# EAGLE design Crousel-Pogobed-Motherboard-A (EAGLE 6.2)
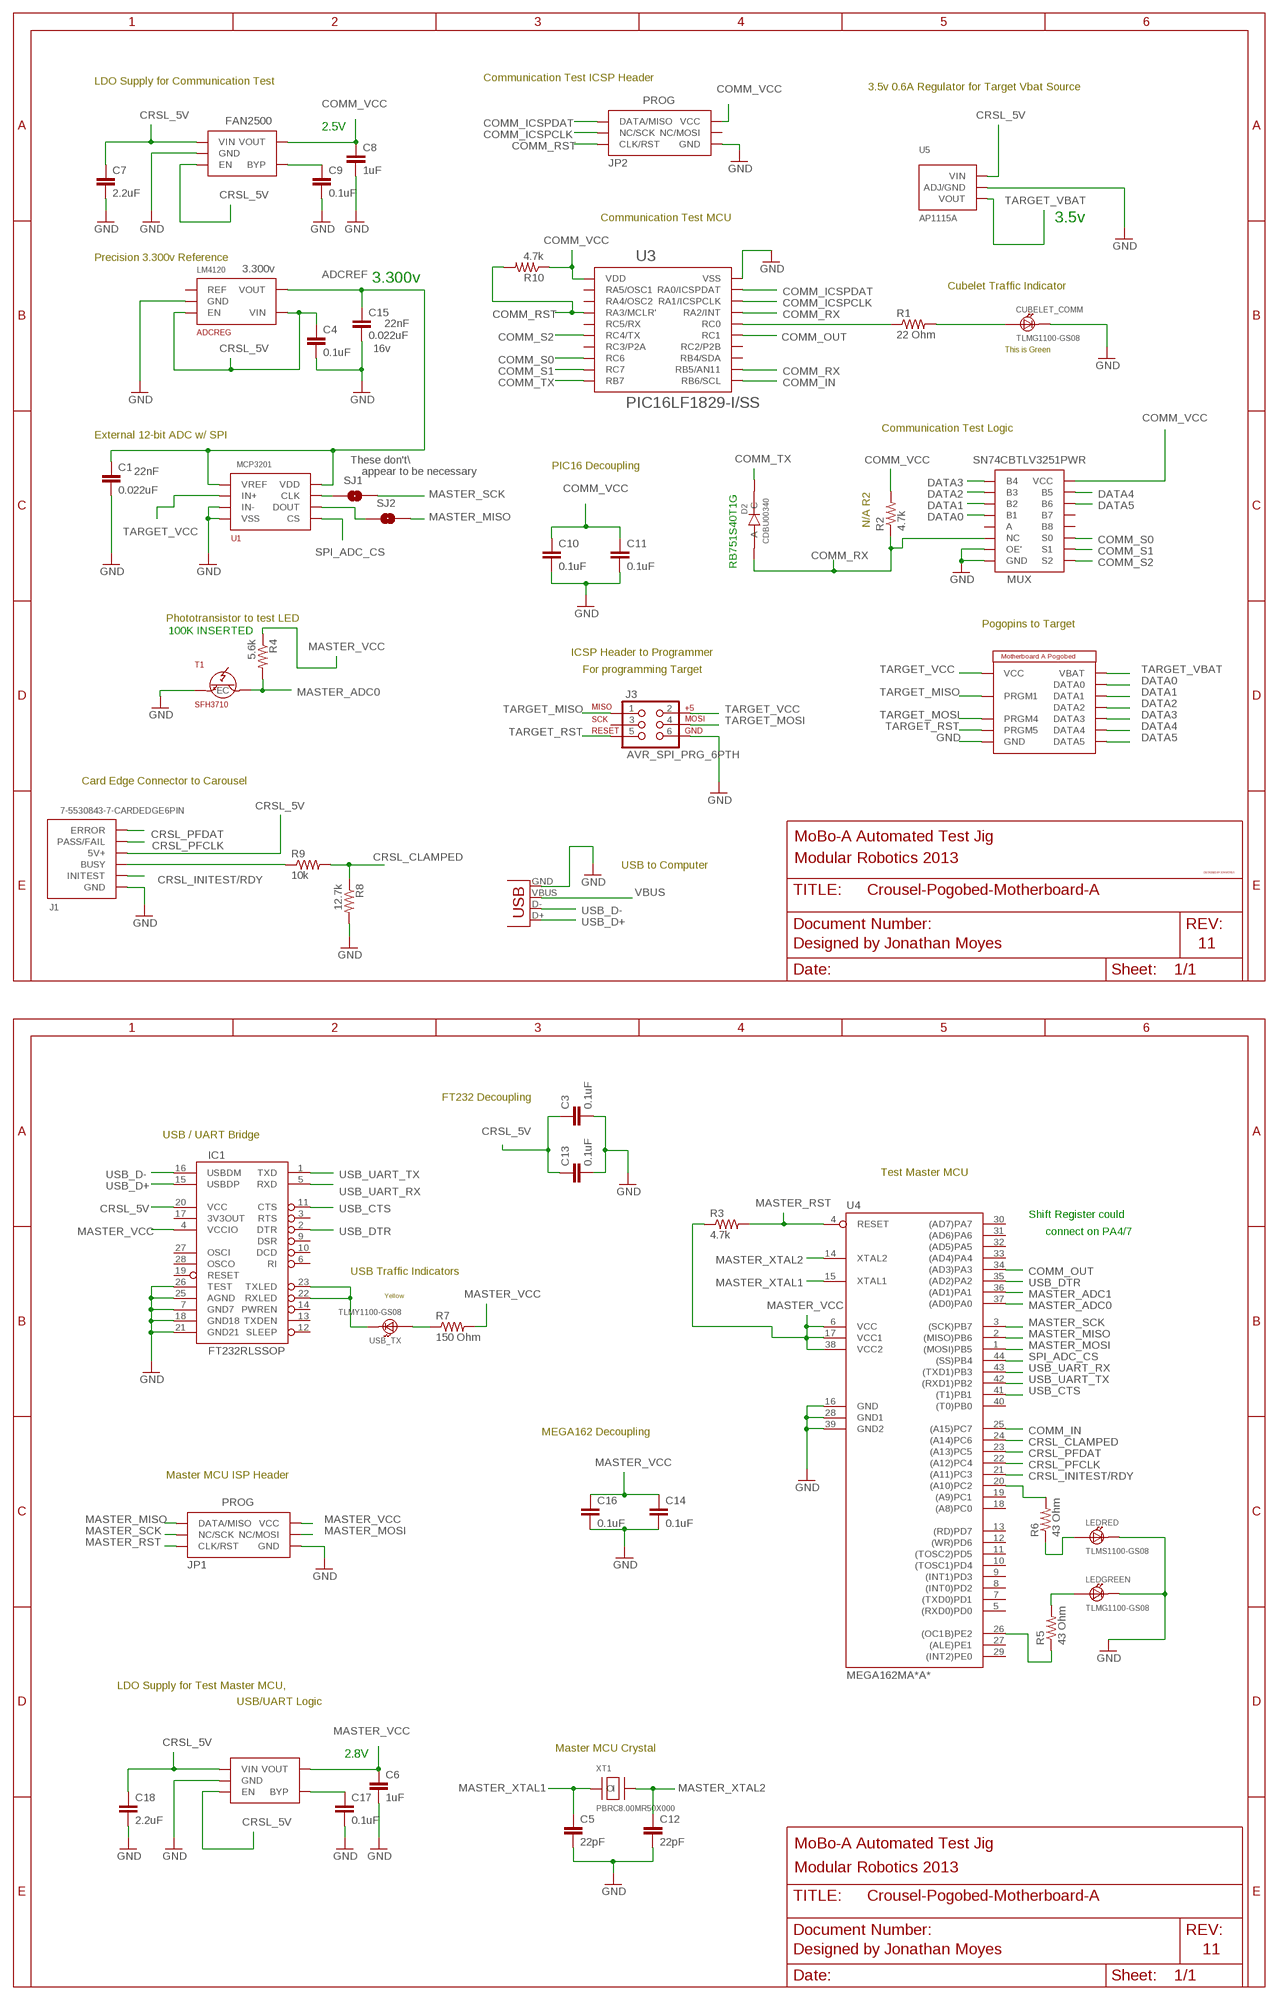
[diagram p0: schematic, sheet 1]

## Parts
2.8V  FAN2500  [FAN2500]
ADCREG  LM4120  [LM4120]
C1  0.022uF  CAP0402-CAP  [0402-CAP]
C3  0.1uF  CAP0402-CAP  [0402-CAP]
C4  0.1uF  CAP0402-CAP  [0402-CAP]
C5  22pF  CAP0402-CAP  [0402-CAP]
C6  1uF  CAP0402-CAP  [0402-CAP]
C7  2.2uF  CAP0402-CAP  [0402-CAP]
C8  1uF  CAP0402-CAP  [0402-CAP]
C9  0.1uF  CAP0402-CAP  [0402-CAP]
C10  0.1uF  CAP0402-CAP  [0402-CAP]
C11  0.1uF  CAP0402-CAP  [0402-CAP]
C12  22pF  CAP0402-CAP  [0402-CAP]
C13  0.1uF  CAP0402-CAP  [0402-CAP]
C14  0.1uF  CAP0402-CAP  [0402-CAP]
C15  0.022uF  CAP0402-CAP  [0402-CAP]
C16  0.1uF  CAP0402-CAP  [0402-CAP]
C17  0.1uF  CAP0402-CAP  [0402-CAP]
C18  2.2uF  CAP0402-CAP  [0402-CAP]
COMMREG  FAN2500  [FAN2500]
CUBELET_COMM  TLMG1100-GS08  [TLM*1100-GS08]
D2  CDBU00340  [CDBU00340]
IC1  FT232RLSSOP  [SSOP28DB]
J1  7-5530843-7-CARDEDGE6PIN  [7-5530843-7-CARDEDGE6PIN]
J2  MOBOA  [MOBOA]
J3  AVR_SPI_PRG_6PTH  [2X3]
JP1  PROG  [PROG]
JP2  PROG  [PROG]
LEDGREEN  TLMG1100-GS08  [TLM*1100-GS08]
LEDRED  TLMS1100-GS08  [TLM*1100-GS08]
MUX  SN74CBTLV3251PWR  [SN74CBTLV3251PWR]
R1  22 Ohm  RESISTOR0402-RES  [0402-RES]
R2  4.7k  RESISTOR0402-RES  [0402-RES]
R3  4.7k  RESISTOR0402-RES  [0402-RES]
R4  5.6k  RESISTOR0402-RES  [0402-RES]
R5  43 Ohm  RESISTOR0402-RES  [0402-RES]
R6  43 Ohm  RESISTOR0402-RES  [0402-RES]
R7  150 Ohm  RESISTOR0402-RES  [0402-RES]
R8  12.7k  RESISTOR0402-RES  [0402-RES]
R9  10k  RESISTOR0402-RES  [0402-RES]
R10  4.7k  RESISTOR0402-RES  [0402-RES]
SJ1  SOLDERJUMPERNO  [SJ_2S-NO]
SJ2  SOLDERJUMPERNO  [SJ_2S-NO]
T1  SFH3710  [SFH3710]
U1  MCP3201  [MCP3201]
U3  PIC16LF1829-I/SS  [PIC16LF1829-I/SS]
U4  MEGA162MA*A*  [TQFP44]
U5  AP1115A  [SOT89]
U$1  JON_MOYES_SIGNATURE  [JON_MOYES_SIGNATURE]
USB_TX  TLMY1100-GS08  [TLM*1100-GS08]
X1  USBPTH  [USB-B-PTH]
XT1  PBRC8.00MR50X000  [PBRC8.00MR50X000]

## Nets
ADCREF: ADCREG.P$5(VOUT) C1.1 C15.1 U1.P$1(VREF) U1.P$8(VDD)
COMM_ICSPCLK: JP2.P$3(NC/SCK) U3.P$18(RA1/ICSPCLK)
COMM_ICSPDAT: JP2.P$1(DATA/MISO) U3.P$19(RA0/ICSPDAT)
COMM_IN: U3.P$11(RB6/SCL) U4.25((A15)PC7)
COMM_OUT: U3.P$15(RC1) U4.34((AD3)PA3)
COMM_RST: JP2.P$5(CLK/RST) R10.2 U3.P$4(RA3/MCLR')
COMM_RX: D2.P$2(A) MUX.P$6(NC) R2.1 U3.P$12(RB5/AN11) U3.P$17(RA2/INT)
COMM_S0: MUX.P$11(S0) U3.P$8(RC6)
COMM_S1: MUX.P$10(S1) U3.P$9(RC7)
COMM_S2: MUX.P$9(S2) U3.P$6(RC4/TX)
COMM_TX: D2.P$1(C) U3.P$10(RB7)
COMM_VCC: C8.1 C10.1 C11.1 COMMREG.P$5(VOUT) JP2.P$2(VCC) MUX.P$16(VCC) R2.2 R10.1 U3.P$1(VDD)
CRSL_5V: 2.8V.P$1(VIN) 2.8V.P$3(EN) ADCREG.P$3(EN) ADCREG.P$4(VIN) C3.1 C4.1 C7.1 C13.1 C18.1 COMMREG.P$1(VIN) COMMREG.P$3(EN) IC1.20(VCC) J1.P$4(5V+) U5.3(VIN)
CRSL_CLAMPED: R8.1 R9.2 U4.24((A14)PC6)
CRSL_INITEST/RDY: J1.P$2(INITEST) U4.21((A11)PC3)
CRSL_PFCLK: J1.P$5(PASS/FAIL) U4.22((A12)PC4)
CRSL_PFDAT: J1.P$6(ERROR) U4.23((A13)PC5)
DATA0: J2.DATA0 MUX.P$4(B1)
DATA1: J2.DATA1 MUX.P$3(B2)
DATA2: J2.DATA2 MUX.P$2(B3)
DATA3: J2.DATA3 MUX.P$1(B4)
DATA4: J2.DATA4 MUX.P$15(B5)
DATA5: J2.DATA5 MUX.P$14(B6)
GND: 2.8V.P$2(GND) ADCREG.P$2(GND) C1.2 C3.2 C4.2 C5.2 C6.2 C7.2 C8.2 C9.2 C10.2 C11.2 C12.2 C13.2 C14.2 C15.2 C16.2 C17.2 C18.2 COMMREG.P$2(GND) CUBELET_COMM.C IC1.7(GND7) IC1.18(GND18) IC1.21(GND21) IC1.25(AGND) IC1.26(TEST) J1.P$3(GND) J2.PRGM6/GND(GND) J3.6 JP1.P$6(GND) JP2.P$6(GND) LEDGREEN.C LEDRED.C MUX.P$7(OE') MUX.P$8(GND) R8.2 T1.E U1.P$3(IN-) U1.P$4(VSS) U3.P$20(VSS) U4.16(GND) U4.28(GND1) U4.39(GND2) U5.2(ADJ/GND) U5.2@1(ADJ/GND) X1.GND
LED1: R6.2 U4.20((A10)PC2)
MASTER_ADC0: R4.2 T1.C U4.37((AD0)PA0)
MASTER_ADC1: U4.36((AD1)PA1)
MASTER_MISO: JP1.P$1(DATA/MISO) SJ2.2 U4.2((MISO)PB6)
MASTER_MOSI: JP1.P$4(NC/MOSI) U4.1((MOSI)PB5)
MASTER_RST: JP1.P$5(CLK/RST) R3.2 U4.4(RESET)
MASTER_SCK: JP1.P$3(NC/SCK) SJ1.2 U4.3((SCK)PB7)
MASTER_VCC: 2.8V.P$5(VOUT) C6.1 C14.1 C16.1 IC1.4(VCCIO) JP1.P$2(VCC) R3.1 R4.1 R7.2 U4.6(VCC) U4.17(VCC1) U4.38(VCC2)
MASTER_XTAL1: C5.1 U4.15(XTAL1) XT1.I
MASTER_XTAL2: C12.1 U4.14(XTAL2) XT1.O
N$1: SJ1.1 U1.P$7(CLK)
N$2: R1.1 U3.P$16(RC0)
N$3: C9.1 COMMREG.P$4(BYP)
N$4: CUBELET_COMM.A R1.2
N$5: 2.8V.P$4(BYP) C17.1
N$6: IC1.22(RXLED) IC1.23(TXLED) USB_TX.C
N$7: R5.1 U4.26((OC1B)PE2)
N$8: R7.1 USB_TX.A
N$9: LEDGREEN.A R5.2
N$10: J1.P$1(BUSY) R9.1
N$11: SJ2.1 U1.P$6(DOUT)
N$12: LEDRED.A R6.1
SPI_ADC_CS: U1.P$5(CS) U4.44((SS)PB4)
TARGET_MISO: J2.PRGM1 J3.1
TARGET_MOSI: J2.PRGM4 J3.4
TARGET_RST: J2.PRGM5 J3.5
TARGET_VBAT: J2.VBAT U5.1(VOUT)
TARGET_VCC: J2.PRGM2/VCC(VCC) J3.2 U1.P$2(IN+)
USB_CTS: IC1.11(CTS) U4.41((T1)PB1)
USB_D+: IC1.15(USBDP) X1.D+
USB_D-: IC1.16(USBDM) X1.D-
USB_DTR: IC1.2(DTR) U4.35((AD2)PA2)
USB_UART_RX: IC1.5(RXD) U4.43((TXD1)PB3)
USB_UART_TX: IC1.1(TXD) U4.42((RXD1)PB2)
VBUS: X1.VBUS
Unconnected: ADCREG.P$1(REF) IC1.3(RTS) IC1.6(RI) IC1.9(DSR) IC1.10(DCD) IC1.12(SLEEP) IC1.13(TXDEN) IC1.14(PWREN) IC1.17(3V3OUT) IC1.19(RESET) IC1.27(OSCI) IC1.28(OSCO) J3.3 JP2.P$4(NC/MOSI) MUX.P$5(A) MUX.P$12(B8) MUX.P$13(B7) U3.P$2(RA5/OSC1) U3.P$3(RA4/OSC2) U3.P$5(RC5/RX) U3.P$7(RC3/P2A) U3.P$13(RB4/SDA) U3.P$14(RC2/P2B) U4.5((RXD0)PD0) U4.7((TXD0)PD1) U4.8((INT0)PD2) U4.9((INT1)PD3) U4.10((TOSC1)PD4) U4.11((TOSC2)PD5) U4.12((WR)PD6) U4.13((RD)PD7) U4.18((A8)PC0) U4.19((A9)PC1) U4.27((ALE)PE1) U4.29((INT2)PE0) U4.30((AD7)PA7) U4.31((AD6)PA6) U4.32((AD5)PA5) U4.33((AD4)PA4) U4.40((T0)PB0)

## Notes on the sheet
- Communication Test ICSP Header
- LDO Supply for Communication Test
- 3.5v 0.6A Regulator for Target Vbat Source
- 2.5V
- Communication Test MCU | 3.5v
- Precision 3.300v Reference
- 3.300v
- 3.300v
- Cubelet Traffic Indicator
- 22nF
- 16v | This is Green
- Communication Test Logic
- External 12-bit ADC w/ SPI
- These don't\
- PIC16 Decoupling
- 22nF | appear to be necessary
- N/A R2
- RB751S40T1G
- Phototransistor to test LED
- Pogopins to Target
- 100K INSERTED
- ICSP Header to Programmer
- For programming Target
- Card Edge Connector to Carousel
- MoBo-A Automated Test Jig
- Modular Robotics 2013
- USB to Computer
- Designed by Jonathan Moyes | 11
- FT232 Decoupling
- USB / UART Bridge
- Test Master MCU
- Shift Register could
- connect on PA4/7
- USB Traffic Indicators
- Yellow
- MEGA162 Decoupling
- Master MCU ISP Header
- LDO Supply for Test Master MCU,
- USB/UART Logic
- Master MCU Crystal
- 2.8V
- MoBo-A Automated Test Jig
- Modular Robotics 2013
- Designed by Jonathan Moyes | 11

## Library data of the parts
2.8V COMMREG = roblocks:FAN2500
ADCREG = ModRobot:LM4120
C1 C3-C18 = SparkFun-Passives:CAP: Capacitor Standard 0603 ceramic capacitor, and 0.1" leaded capacitor.
CUBELET_COMM LEDGREEN = ModRobot:TLMG1100-GS08
D2 = roblocks:CDBU00340
IC1 = SparkFun-DigitalIC:FT232RL: USB UART FT232RL 4th Generation USB UART (USB <-> Serial) Controller. Spark Fun Electronics SKU : COM-00650
J1 = Cubelets_Jon:7-5530843-7-CARDEDGE6PIN
J2 = ModRobot:MOBOA
J3 = SparkFun-Connectors:AVR_SPI_PRG_6: AVR ISP 6 Pin This is the reduced ISP connector for AVR programming. Common on Arduino. This footprint will take up less PCB space and can be used with a 10-pin to 6-pin adapter such as SKU: BOB-08508
JP1 JP2 = roblocks:PROG
LEDRED = ModRobot:TLMS1100-GS08
MUX = roblocks:SN74CBTLV3251PWR
R1-R10 = SparkFun-Passives:RESISTOR: Resistor Basic schematic elements and footprints for 0603, 1206, and PTH resistors.
SJ1 SJ2 = SparkFun-Passives:SOLDERJUMPER: Solder Jumper Standard SMD solder jumper. Used to automate production. Two varients : Normally Open and Normally Closed are the same, but have different paste layers. NC will have a large amount of paste and should jumper during reflow.
T1 = ModRobot:SFH3710
U1 = ModRobot:MCP3201
U3 = roblocks:PIC16LF1829-I/SS
U4 = avr-7:MEGA162*MA: Atmel Mega162 TQFP and MLF packages
U5 = semicon-smd-ipc:AP1115A
U$1 = ModRobot:JON_MOYES_SIGNATURE
USB_TX = ModRobot:TLMY1100-GS08
X1 = SparkFun-Connectors:USB: USB Connectors USB-B-PTH is fully proven SKU : PRT-00139 USB-miniB is fully proven SKU : PRT-00587 USB-A-PCB is untested. USB-A-H is throughly reviewed, but untested. Spark Fun Electronics SKU : PRT-00437 USB-B-SMT is throughly reviewed, but untested. Needs silkscreen touching up. USB-A-S has not been used/tested USB-MB-H has not been used/tested
XT1 = ModRobot:PBRC8.00MR50X000

## Board
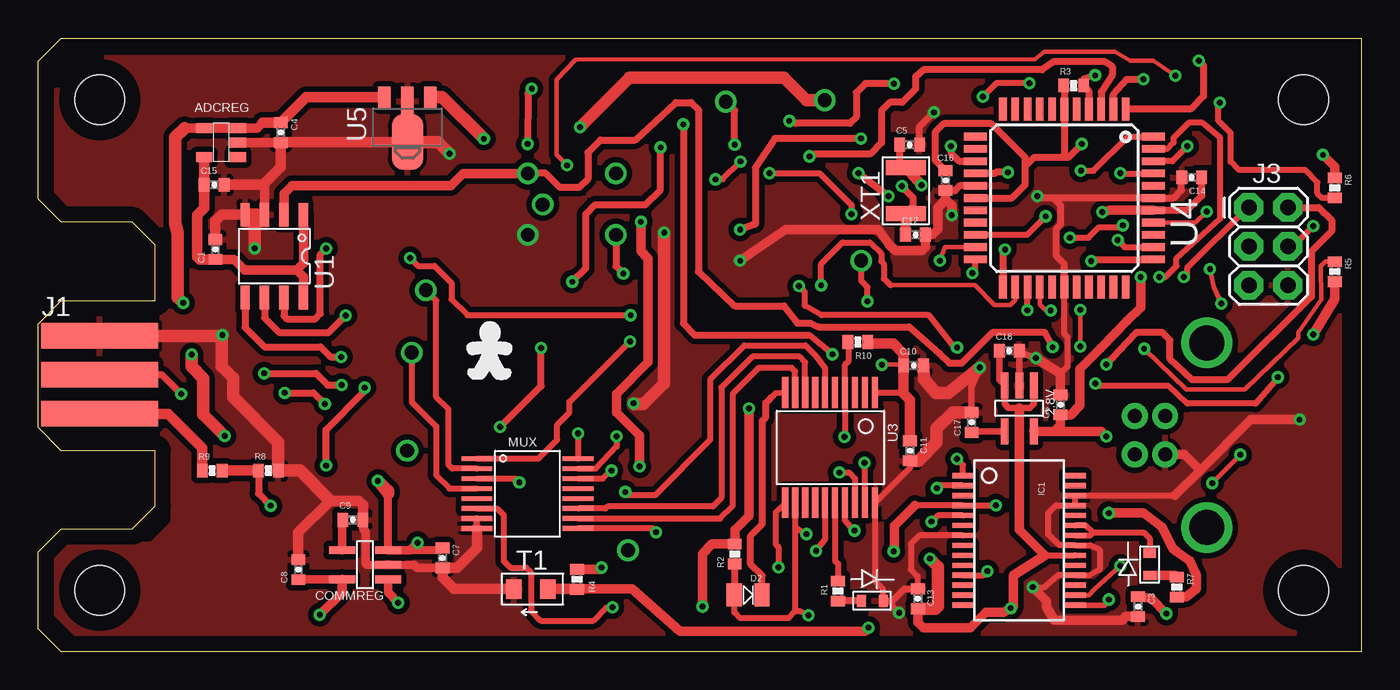
[diagram p1: board, top side]
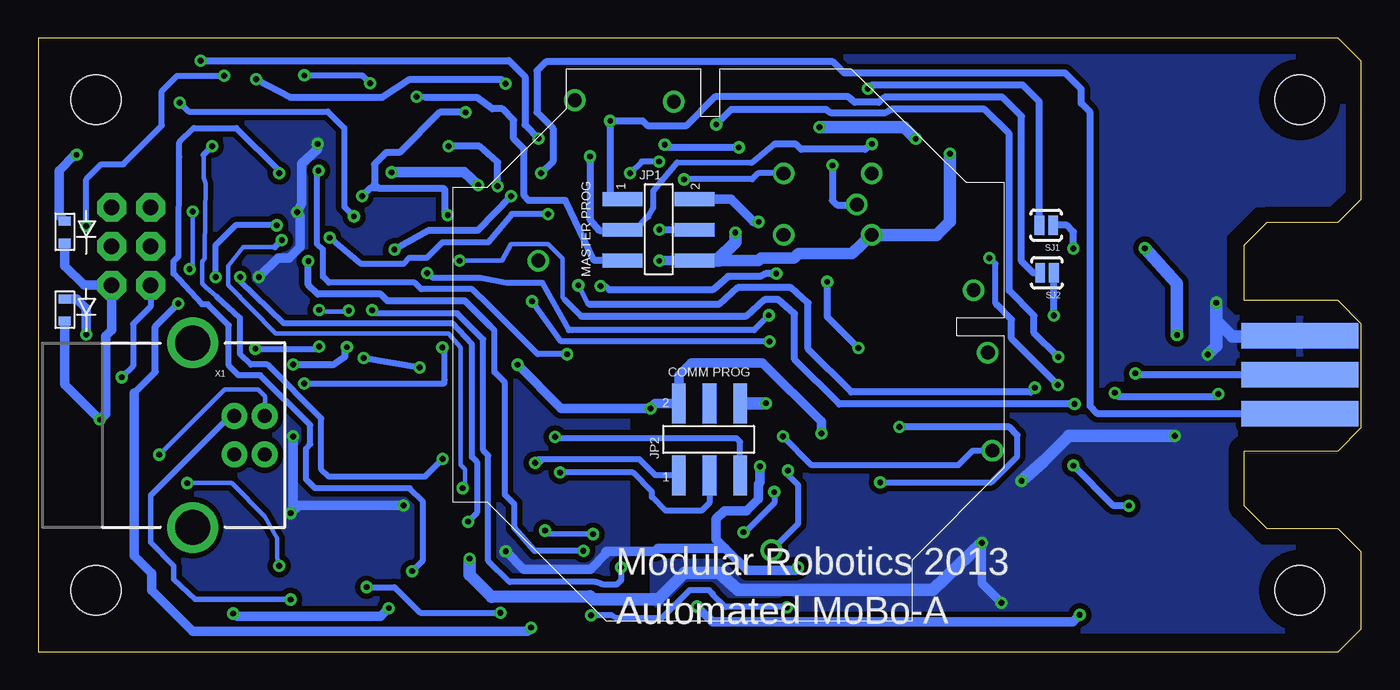
[diagram p2: board, bottom side, seen from below]

Size 86.25 x 40 mm. Coordinates in mm from the lower left corner, seen from the top.
Outline: 1.5,40 86.25,40 86.25,0 1.5,0 0,1.5 0,6.5 1.5,8 6.12,8 7.62,9.5 7.62,13.1 1.5,13.1 0,14.63 0,21.37 1.5,22.9 7.62,22.9 7.62,26.5 6.12,28 1.5,28 0,29.5 0,38.5 1.5,40
Copper layers (1*16): Top 0.035mm / dielectric 1.5mm / Bottom 0.035mm
Design rules: minimum track width 10mil, minimum drill 24mil, track to track 14mil, track to pad 14mil, pad to pad 14mil, via to via 14mil, smd to smd 14mil, copper to edge 40mil, drill to drill 8mil, minimum pad ring 10mil, minimum via ring 8mil, stop-mask expansion 4mil, vias tented up to drill 0mil, thermal gap 10mil
Holes 3.25 mm at 4,4 4,36 82.5,36 82.5,4
tKeepout: area 0.4,0.4 to 7.6,7.6; area 0.4,32.4 to 7.6,39.6; area 78.9,32.4 to 86.1,39.6; area 78.9,0.4 to 86.1,7.6

### Footprints (pad centres in the part's own frame; a part is rotated, then mirrored left to right if it is on the bottom)
FAN2500 = smd 1.7 x 0.5: P$1 0,0; P$2 0,-0.95; P$3 0,-1.9; P$4 3,-1.9; P$5 3,0
LM4120 = smd 1.06 x 0.65: P$1 0,0; P$2 0,-0.95; P$3 0,-1.9; P$4 2.2,-1.9; P$5 2.2,0
0402-CAP = smd 0.7 x 0.9: 1 -0.65,0; 2 0.65,0
TLM*1100-GS08 = smd 0.6 x 0.8: A 0,0; C 1.45,0
CDBU00340 = smd 1 x 1.5: P$1 0,0; P$2 1.8,0
SSOP28DB = smd 0.348 x 1.397: 1 -4.225,-3.656; 2 -3.575,-3.656; 3 -2.925,-3.656; 4 -2.275,-3.656; 5 -1.625,-3.656; 6 -0.975,-3.656; 7 -0.325,-3.656; 8 0.325,-3.656; 9 0.975,-3.656; 10 1.625,-3.656; 11 2.275,-3.656; 12 2.925,-3.656; 13 3.575,-3.656; 14 4.225,-3.656; 15 4.225,3.656; 16 3.575,3.656; 17 2.925,3.656; 18 2.275,3.656; 19 1.625,3.656; 20 0.975,3.656; 21 0.325,3.656; 22 -0.325,3.656; 23 -0.975,3.656; 24 -1.625,3.656; 25 -2.275,3.656; 26 -2.925,3.656; 27 -3.575,3.656; 28 -4.225,3.656
7-5530843-7-CARDEDGE6PIN = smd 7.62 x 1.651: P$1 0,0; P$2 0,2.54; P$3 0,5.08 | smd 7.62 x 1.651 bottom: P$4 0,5.08; P$5 0,2.54; P$6 0,0
MOBOA = drill 0.9 pad 0.813: DATA0 18.5,34.9; DATA1 2.134,14.427; DATA2 14.427,33.985; DATA3 12.5,5.6; DATA4 24.9,35.2; DATA5 31.394,20.803; PRGM1 6.807,21.59; PRGM2/VCC 6.807,27.33; PRGM4 8.839,26.365; PRGM5 10.82,21.59; PRGM6/GND 10.82,27.33; VBAT 2.032,7.976
2X3 = drill 1.016 pad 1.88 octagon: 1 0,0; 2 0,2.54; 3 2.54,0; 4 2.54,2.54; 5 5.08,0; 6 5.08,2.54
PROG = smd 2.6 x 0.9: P$1 0.2,0; P$2 4.88,0; P$3 0.2,-2; P$4 4.88,-2; P$5 0.2,-4; P$6 4.88,-4
SN74CBTLV3251PWR = smd 2 x 0.3: P$1 0,0; P$2 0,-0.65; P$3 0,-1.3; P$4 0,-1.95; P$5 0,-2.6; P$6 0,-3.25; P$7 0,-3.9; P$8 0,-4.55; P$9 6.6,-4.55; P$10 6.6,-3.9; P$11 6.6,-3.25; P$12 6.6,-2.6; P$13 6.6,-1.95; P$14 6.6,-1.3; P$15 6.6,-0.65; P$16 6.6,0
0402-RES = smd 0.7 x 0.9: 1 -0.65,0; 2 0.65,0
SJ_2S-NO = smd 0.635 x 1.27: 1 -0.45,0; 2 0.45,0
SFH3710 = smd 1.25 x 1: C 0,0; E 0,2.2
MCP3201 = smd 0.6 x 1.55: P$1 0,0; P$2 1.27,0; P$3 2.54,0; P$4 3.81,0; P$5 3.81,5.4; P$6 2.54,5.4; P$7 1.27,5.4; P$8 0,5.4
PIC16LF1829-I/SS = smd 2 x 0.4: P$1 0,0; P$2 0,-0.65; P$3 0,-1.3; P$4 0,-1.95; P$5 0,-2.6; P$6 0,-3.25; P$7 0,-3.9; P$8 0,-4.55; P$9 0,-5.2; P$10 0,-5.85; P$11 7.2,-5.85; P$12 7.2,-5.2; P$13 7.2,-4.55; P$14 7.2,-3.9; P$15 7.2,-3.25; P$16 7.2,-2.6; P$17 7.2,-1.95; P$18 7.2,-1.3; P$19 7.2,-0.65; P$20 7.2,0
TQFP44 = smd 1.5 x 0.5: 1 -5.8,4; 2 -5.8,3.2; 3 -5.8,2.4; 4 -5.8,1.6; 5 -5.8,0.8; 6 -5.8,0; 7 -5.8,-0.8; 8 -5.8,-1.6; 9 -5.8,-2.4; 10 -5.8,-3.2; 11 -5.8,-4; 23 5.8,-4; 24 5.8,-3.2; 25 5.8,-2.4; 26 5.8,-1.6; 27 5.8,-0.8; 28 5.8,0; 29 5.8,0.8; 30 5.8,1.6; 31 5.8,2.4; 32 5.8,3.2; 33 5.8,4 | smd 0.5 x 1.5: 12 -4,-5.8; 13 -3.2,-5.8; 14 -2.4,-5.8; 15 -1.6,-5.8; 16 -0.8,-5.8; 17 0,-5.8; 18 0.8,-5.8; 19 1.6,-5.8; 20 2.4,-5.8; 21 3.2,-5.8; 22 4,-5.8; 34 4,5.8; 35 3.2,5.8; 36 2.4,5.8; 37 1.6,5.8; 38 0.8,5.8; 39 0,5.8; 40 -0.8,5.8; 41 -1.6,5.8; 42 -2.4,5.8; 43 -3.2,5.8; 44 -4,5.8
SOT89 = smd 0.8 x 1.4: 1 -1.499,-1.981; 3 1.499,-1.981 | smd 0.8 x 1.9: 2 0,-1.727 | smd 2.032 x 3.65: 2@1 0,0.94
USB-B-PTH = drill 0.914 pad 1.676: D+ 0,1.25; D- 1.981,1.25; GND 0,-1.25; VBUS 1.981,-1.25 | drill 2.286: S1 -2.718,-6.02; S2 -2.718,6.02
PBRC8.00MR50X000 = smd 2.6 x 1: I 0,0; O 0,3

### Placement (x,y rotation side)
2.8V  64.91,17.37 270 top
ADCREG  13.02,32.25 180 top
C1  11.54,26.23 90 top
C3  71.69,2.94 270 top
C4  15.81,33.85 270 top
C5  56.81,33.06 0 top
C6  66.64,16.1 90 top
C7  26.35,6.11 270 top
C8  16.95,5.35 90 top
C9  20.51,8.6 0 top
C10  57.06,18.66 0 top
C11  56.83,13.1 270 top
C12  57.19,27.2 0 top
C13  57.34,3.45 90 top
C14  75.2,30.93 180 top
C15  11.47,30.45 0 top
C16  59.14,30.73 270 top
C17  60.85,14.95 90 top
C18  63.31,19.63 0 top
COMMREG  22.8,4.72 180 top
CUBELET_COMM  53.66,3.32 0 top
D2  47.18,3.7 180 top
IC1  63.95,7.26 270 top
J1  4,15.51 0 top
J2  59.25,38 270 bottom
J3  78.93,28.97 270 top
JP1  48.35,29.51 0 bottom
JP2  44.49,11.29 90 bottom
LEDGREEN  84.52,23 270 bottom
LEDRED  84.52,28.08 270 bottom
MUX  28.59,12.59 0 top
R1  52.13,3.95 270 top
R2  45.4,6.37 90 top
R3  67.5,36.92 0 top
R4  35.12,4.72 270 top
R5  84.52,24.78 270 top
R6  84.52,30.24 270 top
R7  74.23,4.21 270 top
R8  15,11.8 0 top
R9  11.34,11.8 0 top
R10  53.43,20.18 180 top
SJ1  20.54,27.8 180 bottom
SJ2  20.49,24.71 180 bottom
T1  33.21,4.08 90 top
U1  17.29,28.49 180 top
U3  54.55,16.91 270 top
U4  66.89,29.58 270 top
U5  24.07,34.18 180 top
U$1  29.43,19.85 0 top
USB_TX  72.45,4.97 90 top
X1  73.47,14.11 0 bottom
XT1  56.55,31.56 180 top

### Tracks (layer width: path | path; a pad name or v marks a point on that pad's centre or on a via)
ADCREF
  Top 0.61: 12.75,25.58 13.45,24.88 16.83,24.88 | 16.83,24.88 17.29,24.43 U1.P$8 | U1.P$1 17.29,25.34 16.83,24.88
  Top 0.635: C1.1 12.75,25.58
  Top 0.686: ADCREG.P$5 C15.1 10.82,28.93 10.35,28.46 10.35,25.72 10.5,25.57 C1.1
COMM_ICSPCLK  (via drill 0.38)
  Top 0.406: v52.24,11.68 52.87,11.68 53.25,11.29 U3.P$18
  Bottom 0.406: JP2.P$3 42.49,9.71 43.02,9.19 45.35,9.19 46.24,10.07 46.24,10.43 47.49,11.68 v52.24,11.68
COMM_ICSPDAT  (via drill 0.38)
  Top 0.406: U3.P$19 53.9,12.27 v53.86,12.31
  Bottom 0.406: JP2.P$1 46.01,11.49 47.05,12.54 53.38,12.54 | 53.38,12.54 53.63,12.54 v53.86,12.31 53.61,12.31 53.38,12.54
COMM_IN  (via drill 0.38)
  Top 0.406: U3.P$11 48.07,9.08 48.07,7 48.25,6.82 v48.25,5.5 | v64.48,22.27 64.48,23.77 U4.25
  Bottom 0.406: v48.25,5.5 48.25,4.67 48.55,4.36 49.39,4.36 49.54,4.41 49.95,4.54 55.51,4.54 56.91,5.94 56.91,12.79 57.24,13.12 57.24,20.36 58.94,22.06 64.22,22.06 v64.48,22.27
COMM_OUT  (via drill 0.38)
  Top 0.406: U3.P$15 51.3,7.33 v50.71,6.57
  Top 0.457: v68.64,25.47 68.76,25.58 U4.34
  Bottom 0.406: v50.71,6.57 53.89,6.57 55.21,8.07 55.21,9.62 55.82,10.23 55.82,17.54 56.5,18.23 56.5,20.95 56.81,21.25
  Bottom 0.457: 56.81,21.25 58.43,22.88 63.49,22.88 63.92,23.31 68.03,23.31 68.64,23.92 v68.64,25.47
COMM_RST  (via drill 0.38)
  Top 0.406: v52.57,14.01 52.6,14.04 U3.P$4 52.6,18.72 52.84,18.96 52.84,20.12 R10.2
  Bottom 0.406: JP2.P$5 40.49,13.67 40.73,13.91 52.46,13.91 v52.57,14.01
COMM_RX  (via drill 0.38)
  Top 0.406: v53.2,7.89 53.18,7.89 52.59,8.55 U3.P$17 | 49.35,8.14 49.35,2.62 | 49.35,2.62 48.91,2.18 45.76,2.18 45.38,2.56 D2.P$2 | U3.P$12 49.35,8.14 | 49.35,8.14 v50.08,7.66 | v37.43,2.89 37.02,2.86 36.18,2.02 32.75,2.02 32.12,2.66 32.12,5.17 31.81,5.48 30.77,5.48 30.34,5.91 30.34,8.91 29.91,9.34 MUX.P$6 | v50.2,2.38 49.69,2.62 49.35,2.62
  Top 0.457: R2.1 45.4,3.72 D2.P$2
  Bottom 0.406: v50.08,7.66 52.97,7.69 v53.2,7.89 | v37.43,2.89 37.48,2.91 41.44,2.91 42.28,3.75 42.28,3.78 42.51,4 43.78,4 45.61,2.18 48.58,2.18 48.88,2.38 v50.2,2.38
COMM_S0
  Top 0.406: U3.P$8 50,18.87 49.62,19.25 46.55,19.25 44.54,17.24 44.54,10.02 43.98,9.47 37.1,9.47 36.97,9.34 MUX.P$11
COMM_S1
  Top 0.406: U3.P$9 49.35,18.27 49.11,18.51 46.95,18.51 45.28,16.83 45.28,9.52 44.45,8.69 MUX.P$10
COMM_S2  (via drill 0.38)
  Top 0.406: v38.27,10.41 38.47,10.2 40.2,10.2 43.8,13.81 43.8,17.75 46.04,19.98 50,19.98 50.61,19.37 50.81,19.14 51.07,18.79 51.3,18.48 U3.P$6 | v40.27,7.79 40.02,8.04 MUX.P$9
  Bottom 0.406: v38.27,10.41 38.27,9.69 40.17,7.79 v40.27,7.79
COMM_TX
  Top 0.356: 47.77,16.55 48.09,16.88 48.67,16.88 U3.P$10
  Top 0.457: D2.P$1 47.18,4.97 46.44,5.71 46.44,7.56 47.21,8.32 47.21,15.05 47.44,15.28 47.44,16.22 47.77,16.55
COMM_VCC  (via drill 0.38)
  Top 0.305: v55,18.71 56.36,18.71 C10.1
  Top 0.406: U3.P$1 56.33,16.91 56.41,17 | v35.19,14.24 MUX.P$16
  Top 0.432: MUX.P$16
  Top 0.533: 56.85,13.73 C11.1
  Top 0.559: C8.1 16.97,4.72 COMMREG.P$5
  Top 0.61: COMMREG.P$5 19.8,3.85 v18.35,2.41 | v43.3,2.94 43.3,6.39 43.93,7.03 R2.2 45.43,7.04 45.43,7.94 46.34,8.86 v46.34,15.87
  Top 0.686: 56.33,16.91 56.83,16.4 C11.1 | 56.41,17 C10.1 56.4,18.67 56.4,19.42 55.74,20.08 54.18,20.08 R10.1
  Bottom 0.61: v18.35,2.41 18.81,1.95 42.3,1.95 v43.3,2.94 | v55,18.71 52.16,15.87 v46.34,15.87 46.04,16.18 JP2.P$2 44.49,18.05 43.7,18.84 39.03,18.84 35.19,15 v35.19,14.24
CRSL_5V  (via drill 0.38)
  Top 0.406: 65.64,6.28 IC1.20
  Top 0.432: C18.1 62.66,17.71 2.8V.P$3 63.01,16.14 63.26,15.89 63.97,15.89 64.66,15.89 64.91,16.15 2.8V.P$1
  Top 0.533: 26.21,6.62 COMMREG.P$3 22.8,10.3
  Top 0.559: COMMREG.P$1 22.8,3.85 v23.46,3.19 | v24.73,7.1 24.24,6.62 COMMREG.P$3 | C7.1 26.21,6.62
  Top 0.61: C13.1 57.34,1.92 57.72,1.54 60.77,1.54 61.79,2.56 62.93,2.56 v63.4,2.84 | v63.4,2.84 63.56,2.94 63.56,3.06 | 63.56,3.06 63.56,4.97 65.64,6.28 63.97,7.95 63.97,15.89 | C3.1 72.57,3.46 v73.55,2.48 | v63.4,2.84 63.4,2.9 63.56,3.06
  Top 0.635: 14.62,34.51 14.26,34.15 ADCREG.P$3 ADCREG.P$4 9.53,34.15
  Top 0.686: 14.62,34.51 15.8,34.51 C4.1 17.47,36.16 U5.3
  Top 0.813: 9.53,34.15 8.93,33.55 8.93,27.91 9.08,27.3 9.08,23.11 v9.44,22.75 | v12.15,14.06 10.76,15.46 10.76,17.82 10,18.58 v10,19.37 | C13.1 58.49,2.8 58.66,2.96 58.66,5.53 v58.13,6.06 | 22.8,10.3 22.8,10.48 v22.14,11.14 22.8,10.3
  Bottom 0.559: v23.46,3.19 24.73,4.46 v24.73,7.1
  Bottom 0.61: v73.55,2.48 73.29,2.3 63.93,2.3 v63.4,2.84
  Bottom 0.813: v9.44,22.75 9.44,21.61 | 9.44,21.61 8.4,20.57 4.03,20.57 J1.P$4 | 9.44,21.61 9.44,19.93 v10,19.37 | v12.15,14.06 19.06,14.06 20.76,12.36 v22.14,11.14 | v24.73,7.1 27.93,4.03 40.63,4.03 41.87,5.15 44.11,5.15 45.84,3.42 50.08,3.42 50.28,3.6 56.71,3.57 58.13,5 v58.13,6.06
  pour Bottom: 4,39.01 42.61,39.01 46.16,35.45 46.16,3.32 44.26,1.41 3.37,1.41 1.72,3.06 1.72,5.35 3.11,6.75 6.54,6.75 8.19,8.4 8.19,13.86 7.68,14.37 2.48,14.37 1.21,15.64 1.21,20.72 2.22,21.73 8.32,21.73 8.95,22.37 8.95,27.2 6.92,29.23 2.1,29.23 1.08,30.24 1.08,36.09
CRSL_CLAMPED  (via drill 0.38)
  Top 0.305: U4.24 63.69,22.93 63.36,22.6 62.34,22.6 61.05,23.89 55.56,23.89
  Top 0.406: v51.04,23.89 51.04,25.29 52.44,26.69 54.22,26.69 54.95,25.95 54.95,25.47 55.13,25.29 55.13,24.32 55.56,23.89
  Top 0.457: R8.1 14.35,10.32 v15.15,9.52 | v18.76,12.13 18.76,14.47 21.27,16.98 v21.27,17.21
  Top 0.686: R9.2 R8.1
  Bottom 0.305: 50.28,22.65 50.41,22.65 v51.04,23.89
  Bottom 0.457: v15.15,9.52 16.14,9.52 v18.76,12.13 | v21.27,17.21 21.55,16.93 33.24,16.93 36.06,19.75 36.06,22.75 37.17,23.74 40.65,23.74 41.87,22.65 50.28,22.65
CRSL_INITEST/RDY  (via drill 0.38)
  Top 0.305: U4.21 59.12,26.38 v58.79,25.49
  Top 0.457: v9.31,16.81 8.07,18.05 J1.P$2 | v16.07,16.88 17.95,16.88 v18.68,16.15
  Bottom 0.305: 51.93,22.95 52.06,23.08 52.06,25.65 53,26.59 55.44,26.59 56.02,25.49 v58.79,25.49
  Bottom 0.33: 9.41,16.7 v9.31,16.81
  Bottom 0.406: 50.84,21.86 51.93,22.95
  Bottom 0.457: v9.31,16.81 9.49,16.63 15.81,16.63 v16.07,16.88 | v18.68,16.15 34.02,16.15 36.95,19.07 36.95,22.04 37.99,22.95 38.9,22.95 40.12,21.86 50.84,21.86
CRSL_PFCLK  (via drill 0.38)
  Top 0.381: v38.62,21.94 27.98,21.94 26.94,22.98 26.94,24.04 25.82,25.16 24.75,25.16 v24.24,25.67
  Top 0.406: v60.9,24.68 61.09,24.88 U4.22
  Top 0.457: v14.72,18.15 18.1,18.15 18.86,17.39 v19.77,17.39
  Bottom 0.33: 14.62,18.05 v14.72,18.15
  Bottom 0.381: 23.76,22.62 23.84,22.7 23.84,25.29 24.22,25.67 v24.24,25.67 | v38.62,21.94 39.59,20.97 51.42,20.97
  Bottom 0.406: 51.42,20.97 51.65,20.97 53.38,24.04 55.74,24.04 57.42,24.38 60.52,24.38 60.82,24.68 v60.9,24.68
  Bottom 0.457: J1.P$5 14.62,18.05 | v19.77,17.39 22.8,20.41 22.8,21.66 23.76,22.62
CRSL_PFDAT  (via drill 0.38)
  Top 0.457: v63.03,26.23 62.89,26.09 U4.23 | v53.48,31.21 54.98,30.06 v55.44,29.71
  Bottom 0.457: J1.P$6 17.18,15.51 17.67,15.99 17.67,35.17 18.25,35.76 18.25,36.7 19.29,37.74 33.69,37.74 34.43,38.47 53.15,38.47 53.73,37.89 53.73,35.17 52.69,34.13 52.69,31.97 v53.48,31.21 | v55.44,29.71 57.59,27.47 60.8,27.47 v63.03,26.23
DATA0
  Top 0.406: J2.DATA0 24.35,16.3 25.95,14.7 25.95,11.5 26.81,10.63 MUX.P$4
DATA1  (via drill 0.38)
  Top 0.406: MUX.P$3 31.11,11.29 v31.36,11.04
  Top 0.457: v30.11,14.65 32.78,17.31 v32.78,19.8 | v34.81,24.12 35.7,25.01 35.7,28.54 36.31,29.15 39.59,29.15 40.55,30.12 40.55,32.86 v40.58,32.89 | v45.4,33.06 45.4,35.28 J2.DATA1
  Bottom 0.406: v31.36,11.04 24.12,11.04 22.42,12.74 22.42,14.11
  Bottom 0.457: 22.42,14.11 22.95,14.65 v30.11,14.65 | v32.78,19.8 34.81,21.84 v34.81,24.12 | v40.58,32.89 45.23,32.89 v45.4,33.06
DATA2
  Top 0.406: MUX.P$2 26.98,11.94 26.73,12.18 26.73,15.82 25.95,16.6 25.95,22.89 J2.DATA2
DATA3  (via drill 0.38)
  Top 0.406: MUX.P$1 32.6,12.59 33.82,13.81 33.82,14.8 34.63,15.61 34.63,16.3 v38.57,20.23 | v54.06,22.85 54.06,23.77 53.66,24.17 J2.DATA3
  Bottom 0.406: v38.57,20.23 52.16,20.23 v54.06,22.85
DATA4  (via drill 0.38)
  Top 0.406: v37.71,14.04 37.71,13.38 36.34,11.93 35.2,11.93 MUX.P$15
  Bottom 0.406: J2.DATA4 25.33,13.1 26.28,12.16 35.83,12.16 v37.71,14.04
DATA5  (via drill 0.38)
  Top 0.406: MUX.P$14 36.81,11.29 v37.38,11.8
  Bottom 0.406: v37.38,11.8 37.35,11.5 36.72,10.86 36.72,8.33 J2.DATA5
GND  (via drill 0.38)
  Top 0.406: 74.11,10.18 IC1.26 IC1.25 67.59,9.54 66.36,9.54 65.85,9.03 65.85,7.64 66.56,6.93 IC1.21 68.59,6.93 69.2,6.62 69.2,5.35 68.53,4.98 IC1.18 66.5,4.98 66.48,4.97 65.72,4.33 65.6,4.21 v64.83,4.21 | CUBELET_COMM.C 55.05,3.37 55.05,4.08 54.55,4.59 U3.P$20 56.83,11.99 C11.2 | IC1.7 57.44,7.58 56.88,7.03 56.88,5.35 57.32,4.92 57.32,4.12 C13.2 | v56.12,2.53 55.69,2.96 55.69,3.32 | U4.28 66.89,20.72 67.09,20.52 67.09,18.58 66.64,18.13
  Top 0.432: 2.8V.P$2 C18.2 64.25,19.4 v65.04,19.14 | C17.2 60.85,17.26 v61.38,18.53 | MUX.P$7 MUX.P$8
  Top 0.457: CUBELET_COMM.C 55.69,3.32 56.45,4.08 57.33,4.08 C13.2 | U4.16 60.07,30.38 59.75,30.06 59.16,30.06 C16.2 59.16,30.12 | v58.38,35.17 57.46,34.25 C5.2 | 74.54,30.92 74.54,30.09 74.03,29.58 U4.39 66.18,29.58 | 66.18,29.58 65.27,29.58 v65.14,29.71 | U4.28 66.89,25.29 66.38,25.8 66.38,27.6 66.66,27.88 66.66,29.1 66.18,29.58
  Top 0.508: 2.8V.P$2
  Top 0.533: 21.42,5.66 22.79,5.66 | COMMREG.P$2 24.49,5.67
  Top 0.559: 21.17,8.61 C9.2 21.16,8 21.32,7.84 21.32,5.76 21.42,5.66 | 16.93,6.03 C8.2 | 22.79,5.66 COMMREG.P$2 | 24.49,5.67 24.7,5.45 26.34,5.45 C7.2
  Top 0.584: 74.54,30.92 C14.2
  Top 0.61: C3.2 70.92,2.29 70.68,2.05 66.25,2.03 65.72,2.94 65.72,3.32 v64.83,4.21 | 74.11,10.18 75.76,11.83 | 14.24,28.49 U1.P$3 14.75,30.34 14.64,30.45 | v59.55,28.46 59.55,29.07 59.14,29.48 | C16.2 59.14,29.48 | 58.64,28.87 58.64,28.97 59.14,29.48 | C6.2 66.64,18.13 v65.04,19.14 | 75.76,11.83 74.72,12.86 X1.GND | 75.76,11.83 79.06,15.13 v82.23,15.13
  Top 0.635: C4.2 ADCREG.P$2 | v45.76,25.49 48.71,27.52 54.78,27.52 55.46,26.59 55.46,26.56 55.87,26.15 57.62,26.15 57.84,26.37 C12.2 58.28,27.2 58.64,27.55 58.64,28.87
  Top 0.686: C15.2 14.64,30.45 15.81,31.61 C4.2 | C1.2 11.54,28.08 11.95,28.49 U1.P$4 | C4.2 | C4.2 15.85,33.24 U5.2@1 U5.2 | 21.17,8.61 21.17,9.57 20.89,9.85 19.01,9.85 16.93,7.76 16.93,6.03 | T1.E 27.11,4.08 26.35,4.84 C7.2 27.3,5.46 28.61,6.77 28.61,8.01 MUX.P$8
  Top 0.813: U1.P$4 14.24,28.49 14.11,28.31 v14.11,26.31 | J1.P$3 11.95,20.59 | 11.95,20.59 v12,20.64 | 11.95,20.59 11.95,18.58 12.69,17.85 12.69,16.6 15.65,13.64 R8.2 17.06,11.8 19.01,9.85 | U5.2@1 26.05,33.24 v26.81,32.48 | v38.8,16.2 38.85,16.15 39.46,16.15 40.81,17.49 v40.81,27.32 | C11.2 57.38,12.45 58.56,13.63 58.56,14.55 59.63,15.61 60.84,15.61 C17.2 | C10.2 57.75,17.77 58.51,16.88 59.32,16.88 v61.38,18.53
  Bottom 0.406: v64.83,4.21 63.03,4.21 61.35,2.53 v56.12,2.53
  Bottom 0.432: v61.38,18.53 v65.04,19.14
  Bottom 0.457: v58.38,35.17 60.08,35.17 62.7,32.55 63.56,32.55 64.33,31.79 64.33,30.5 64.05,30.22 | 64.05,30.22 59.86,30.22 59.75,30.12 59.75,28.67 v59.55,28.46 | 64.05,30.22 64.63,30.22 v65.14,29.71
  Bottom 0.61: LEDGREEN.C 84.52,17.42 v82.23,15.13 81.85,15.51 81.85,20.59 81.47,20.97 J3.6 83.25,23.89 84.52,25.16 LEDRED.C
  Bottom 0.635: JP1.P$6 45.75,25.51 v45.76,25.49
  Bottom 0.762: J2.PRGM6/GND 33.2,25.95 36.69,25.95 36.97,25.67 39.13,25.67 39.29,25.51 42.08,25.51
  Bottom 0.813: v12,20.64 12,24.02 v14.11,26.31 | v26.81,32.48 26.81,28.06 27.7,27.17 31.91,27.17 J2.PRGM6/GND | 43.43,25.47 JP1.P$6 42.08,25.51 42.03,25.51 | 42.03,25.51 41.86,25.51 | v38.8,16.2 40.47,16.2 JP2.P$6 | v40.81,27.32 40.81,26.73 42.03,25.51
  pour Top: 6.29,38.75 82.49,38.75 84.77,36.47 84.77,4.08 81.85,1.16 2.48,1.16 1.08,2.56 1.08,6.37 1.72,7 7.43,7 8.83,8.4 8.83,13.22 8.07,13.99 2.48,13.99 1.21,15.26 1.21,20.59 2.35,21.73 7.68,21.73 8.45,22.5 8.45,27.2 6.54,29.1 1.97,29.1 1.08,29.99 1.08,36.47 3.37,38.75
LED1  (via drill 0.38)
  Top 0.381: R6.2 83.7,29.59 83.4,29.89 83.4,30.6 82.59,31.41 78.27,31.41 77.74,31.94 77.74,33.82 76.92,34.64 76.92,35.7 v77.03,35.81 | v65.67,28.39 64.47,27.18 U4.20
  Bottom 0.381: v77.03,35.81 76.44,35.22 67.37,35.22 66.31,34.16 66.31,29.02 v65.67,28.39
MASTER_ADC0  (via drill 0.38)
  Top 0.305: U4.37 75.43,27.98 v76.19,28.69 | v77.13,22.7 76.64,23.77 v76.39,24.96
  Top 0.61: R4.2 35.1,4.08 38.72,4.08 41.82,1.34 53.89,1.34 v54.12,1.57
  Top 0.686: T1.C 35.1,4.08
  Bottom 0.305: v76.39,24.96 76.24,25.06 76.19,25.16 v76.19,28.69
  Bottom 0.457: 80,16.88 78.63,18.25 78.63,21.2 v77.13,22.7
  Bottom 0.61: v54.12,1.57 54.34,1.34 76.19,1.34 78.86,4 78.86,5.1 80,6.24 80,16.88
MASTER_MISO  (via drill 0.38)
  Top 0.457: U4.2 70.09,36.36 70.95,37.33 v72.05,37.33 | v55.79,37.05 53.91,37.05 53.33,36.47 53.33,34.87 52.92,34.46 49.39,34.46 v48.96,34.61
  Bottom 0.457: SJ2.2 21.38,24.71 22.14,25.47 22.14,34.92 23.38,36.16 31.08,36.16 31.46,35.83 33.01,35.83 33.41,36.19 42.13,36.19 44.03,34.28 46.5,34.28 46.83,34.61 v48.96,34.61 48.96,29.76 JP1.P$1 | v72.05,37.33 69.81,36.16 63.82,36.16 62.04,37.33 56.07,37.33 v55.79,37.05
MASTER_MOSI  (via drill 0.38)
  Top 0.457: v53.63,33.47 48.02,33.47 46.75,31.56 46.75,27.88 v45.76,27.52 | U4.1 75.13,35.38 75.96,36.21 75.96,38.24 v75.65,38.55
  Bottom 0.457: v75.65,38.55 55.56,38.55 54.52,37.51 54.52,34.36 v53.63,33.47 | v45.76,27.52 43.49,27.52 JP1.P$4
MASTER_RST  (via drill 0.38)
  Top 0.406: R3.2 68.15,37.4 v68.9,37.58 | v64.61,37.08 62.47,37.08 v61.58,36.19
  Top 0.457: U4.4 68.49,36.58 R3.2
  Bottom 0.406: v68.9,37.58 65.14,37.58 v64.61,37.08 | v61.58,36.19 61.02,36.19 60.97,36.14
  Bottom 0.457: JP1.P$5 50.01,25.51 51.88,29.43 54.29,29.43 54.57,29.73 54.57,32.76 55.26,33.44 55.26,34.66 56,35.4 56.66,35.4 57.65,36.14 60.97,36.14
MASTER_SCK  (via drill 0.38)
  Top 0.457: v50.28,32.3 50.64,32.45 54.24,32.45 54.98,33.19 54.98,35.3 55.51,35.83 56.33,35.83 57.19,36.7 57.19,37.51 57.7,37.94 65.44,37.94 66.18,38.47 69.56,38.47 70.02,38.17 70.02,37.61 69.3,36.49 U4.3 | v32.17,36.72 31.92,36.42 v31.89,33.11
  Bottom 0.381: 31.89,36.95 v32.17,36.72 | 38.27,33.09 39.76,31.87 44.59,31.89 46.16,30.04 46.16,28.95 46.5,28.39 46.5,28.36 47.35,27.51 JP1.P$3
  Bottom 0.457: SJ1.2 20.99,35.88 22.06,36.95 31.89,36.95 | v50.28,32.3 50.28,28.19 49.67,27.47 48.21,27.45 JP1.P$3 | v31.89,33.11 32.35,32.76 36.51,32.76 36.84,33.09 38.27,33.09
MASTER_VCC  (via drill 0.38)
  Top 0.356: 62.41,9.53 v62.42,9.54
  Top 0.406: 62.41,9.53 IC1.4 57.15,9.53
  Top 0.432: 2.8V.P$5
  Top 0.457: U4.17 63.49,29.58 64.35,30.45 64.35,31.67 | 64.35,31.67 64.35,32.22 62.14,34.43 59.02,34.43 58.46,33.88 58.46,32.06 C16.1 | 66.69,32.22 66.89,32.43 U4.6 66.89,36.88 R3.1 | 66.69,32.22 64.91,32.22 64.35,31.67 | U4.38 74.91,28.78 75.86,29.73 C14.1 | v68.03,33.11 67.14,32.22 66.69,32.22
  Top 0.584: C14.1
  Top 0.61: v69.79,9.03 72.05,9.03 73.24,8.14 73.98,6.75 74.23,6.49 75.07,5.91 75.5,5.02 75.5,4.08 74.84,3.57 74.25,3.57 R7.2 | 66.21,14.37 2.8V.P$5 | 66.21,14.37 69.3,14.37 v69.64,14.04 | 57.15,9.53 55.82,8.2 55.82,6.6 v55.77,6.54 | v36.72,5.48 36.6,5.37 R4.1 | 66.21,14.37 66.64,14.8 C6.1 67.32,15.44 67.91,16.05 67.91,18.43 69.23,19.78 70.22,20.77 70.95,21.56 71.87,22.45 v71.87,24.43 | U4.38 69.85,28.78 v69.38,28.67
  Top 0.635: v39.28,28.03 39.28,26.13 39.76,25.65 39.76,18.89 37.68,16.81 37.68,15.61 39.21,14.09 v39.21,12.08
  Bottom 0.457: 68.03,32.76 v68.03,33.11
  Bottom 0.61: v62.42,9.54 69.28,9.54 v69.79,9.03 69.64,9.19 v69.64,14.04 | v36.72,5.48 36.89,5.3 40.02,5.3 41.47,6.75 45.84,6.75 46.04,6.54 49.19,6.54 49.26,6.47 49.26,6.37 50.25,5.38 54.6,5.38 v55.77,6.54 | 68.03,32.76 69.08,31.82 69.08,29.23 v69.38,28.67 69.18,28.41 69.18,26.38 69.89,25.67 70.62,25.67 v71.87,24.43
  Bottom 0.635: JP1.P$2 41.09,29.51 39.61,28.03 v39.28,28.03 | v39.21,12.08 39.21,11.04 39.31,10.94 39.31,9.95 40.07,9.19 41.52,9.19 42.05,8.65 42.05,7.33 41.47,6.75
  pour Bottom: 50.36,39.13 81.98,39.13 85.28,35.83 85.28,4.21 82.23,1.16 50.36,1.16 47.82,3.7 47.82,36.59
MASTER_XTAL1  (via drill 0.38)
  Top 0.406: 56.56,31.57 XT1.I
  Top 0.457: v63.21,31.26 62.45,31.26 62.37,31.18 U4.15 | C5.1 56.16,31.96 XT1.I
  Top 0.686: v57.57,30.42 XT1.I
  Bottom 0.686: v63.21,31.26 58.48,31.28 v57.57,30.42
MASTER_XTAL2  (via drill 0.38)
  Top 0.457: 56.55,28.39 XT1.O 57.04,29.05 57.04,29.61 56.3,30.34 v56.3,30.37 | v59.5,32.96 59.5,32.5 60.01,32 61.08,32 U4.14
  Top 0.635: 56.55,28.39 56.54,28.37 C12.1
  Bottom 0.457: 59.37,32.83 v59.5,32.96 57.49,32.96 56.3,31.92 v56.3,30.37
N$1  (via drill 0.38)
  Top 0.457: U1.P$7 16.01,21.91 16.22,21.71 18.05,21.71 18.38,22.04 18.38,25.9 v18.76,26.28
  Bottom 0.457: v18.76,26.28 18.76,27.37 19.19,27.8 SJ1.1
N$2
  Top 0.406: U3.P$16 51.95,5.92 52.13,5.73 R1.1
N$3
  Top 0.559: C9.1 19.8,8.54 COMMREG.P$4
N$4
  Top 0.457: CUBELET_COMM.A 52.15,3.32 R1.2
N$5
  Top 0.432: C17.1 60.91,14.36 2.8V.P$4
N$6
  Top 0.381: IC1.22 68.59,7.58 68.77,7.76 | 68.77,7.76 68.3,8.23 IC1.23 | 68.77,7.76 72.07,7.76 72.45,7.38 USB_TX.C
N$7  (via drill 0.38)
  Top 0.305: R5.1 83.9,25.43 83.61,25.16 83.63,22.98 82.16,20.82 82.16,20.46 78.65,17.09 74.84,17.09 v72.1,19.75 | v67.93,19.9 v67.93,22.29 | v66,22.24 65.7,22.24 65.29,22.65 U4.26
  Bottom 0.305: v67.93,22.29 67.83,22.19 66.05,22.19 v66,22.24
  Bottom 0.406: v72.1,19.75 68.09,19.75 v67.93,19.9
N$8
  Top 0.61: USB_TX.A 74.12,4.97 R7.1
N$9  (via drill 0.38)
  Top 0.61: R5.2 LEDGREEN.A v83.12,20.69
  Bottom 0.61: v83.12,20.69 83.12,22.37 83.76,23 LEDGREEN.A
N$10
  Top 0.686: J1.P$1 8.47,15.51 10.68,13.3 R9.1
N$11  (via drill 0.38)
  Top 0.457: U1.P$6 14.75,21.76 15.69,20.82 18.94,20.82 v20.03,21.91
  Bottom 0.457: v20.03,21.91 20.03,24.7 SJ2.1
N$12  (via drill 0.38)
  Top 0.61: R6.1 84.52,31.64 v83.76,32.4
  Bottom 0.61: v83.76,32.4 83.88,32.4 84.9,31.39 84.9,28.46 LEDRED.A
SPI_ADC_CS  (via drill 0.38)
  Top 0.406: v67.98,31.36 68.8,31.36 71.02,33.58 U4.44 | 50.23,20.64 50.23,20.67 v51.78,19.4
  Top 0.457: U1.P$5 13.47,21.15 14.75,19.88 18.4,19.88 19.06,19.22 v19.75,19.22 | v42.05,34.38 42.05,21.4 42.79,20.64 50.23,20.64
  Bottom 0.406: v67.98,31.36 68.09,31.26 68.09,26.59 67.68,26.23 67.68,24.45 67.3,24.07 61.71,24.07 61.28,23.64 57.95,23.64 57.42,23.11 57.39,23.11 53.68,19.4 v51.78,19.4
  Bottom 0.457: v19.75,19.22 21.32,20.79 21.32,21.91 22.95,23.54 22.95,33.77 24.55,35.37 30.62,35.37 30.62,35.35 31.05,35.12 34.56,35.12 34.89,35.35 41.09,35.35 v42.05,34.38
TARGET_MISO  (via drill 0.38)
  Top 0.406: v47.66,31.21 50.94,31.21 53.02,29.12 v53.02,28.54 53,28.54 | v67.25,26.99 68.47,26.99 69.15,27.68 70.57,27.68 v70.7,27.8 | J3.1 78.86,28.97 74.89,25.01 74.89,24.63 v74.69,24.43 | v44.16,30.8 44.62,30.8 v45.78,31.97
  Bottom 0.406: J2.PRGM1 39.32,31.19 39.71,30.8 v44.16,30.8 | v47.66,31.21 46.9,31.97 v45.78,31.97 | v53.02,28.54 55.36,28.54 56.91,26.69 59.91,26.69 60.92,25.67 62.07,25.67 62.45,25.29 65.19,25.29 v67.25,26.99 | v70.7,27.8 73.39,27.8 74.69,26.51 v74.69,24.43
TARGET_MOSI  (via drill 0.38)
  Top 0.305: v74.13,37.56 73.83,37.76 72.68,38.55 71.18,38.55 70.19,39.13 65.6,39.13 64.96,38.62 35.04,38.6 33.8,37.3 33.8,32.4 v34.48,31.72
  Top 0.381: J3.4 81.8,26.43 v83.12,27.75
  Bottom 0.381: v83.12,27.75 83.12,30.8 82.13,31.79 80.71,31.79 78.19,34.31 78.19,36.57 77.2,37.56 v74.13,37.56
  Bottom 0.457: v34.48,31.72 34.48,29.43 34.18,29.12 32.92,29.12 J2.PRGM4
TARGET_RST  (via drill 0.38)
  Top 0.406: v80.81,17.9 80.81,17.85 79.36,16.17 74.92,16.17 73.7,17.31 69.1,17.31 v68.92,17.49 | v59.91,19.83 59.63,19.98 58.05,21.94 51.07,21.94 49.98,22.57 49.98,23.46 v49.59,23.84
  Top 0.457: J2.PRGM5 37.66,25.14 v38.14,24.65
  Bottom 0.406: J3.5 78.93,22.5 80.07,21.35 80.07,18.63 v80.81,17.9 | v68.92,17.49 59.78,17.49 59.75,17.72 59.75,19.6 v59.91,19.83 | v49.59,23.84 49.26,23.84 49.01,23.59
  Bottom 0.457: v38.14,24.65 38.82,24.65 39.16,24.48 41.29,24.48 42.3,23.59 49.01,23.59
TARGET_VBAT  (via drill 0.38)
  Top 0.813: J2.VBAT 50.07,35.97 48.6,37.43 38.55,37.43 v35.32,34.21 | v29.04,33.44 26.33,36.16 U5.1
  Bottom 0.813: v35.32,34.21 29.81,34.21 v29.04,33.44
TARGET_VCC  (via drill 0.38)
  Top 0.457: J2.PRGM2/VCC 33.07,31.19 34,30.27 35.27,30.27 35.83,30.83 35.83,32.55 36.64,33.37 38.93,33.37 41.57,35.81 42.56,35.81 43.04,35.35 43.04,24.78 45.4,22.55 48.63,22.55 49.49,21.43 50.36,21.43 50.86,21.18 56.78,21.18 58.76,19.45 59.4,18.81 60.21,18.81 62.24,20.84 65.6,20.84 v66.13,19.85 | J3.2 83.48,28.97 84.32,28.13 84.32,27.42 83,26.08 83,23.16 77.51,17.72 75.22,17.72 73.78,19.09 73.78,20.31 73.27,20.82 71.59,20.82 70.91,20.11 70.52,19.68 70.07,19.17 v69.64,18.74
  Top 0.61: J2.PRGM2/VCC 31.91,31.18 27.7,31.18 26.91,30.39 16.55,30.39 16.01,29.86 U1.P$2
  Bottom 0.457: v69.64,18.74 66.99,18.74 66.26,19.25 66.23,19.75 v66.13,19.85
USB_CTS  (via drill 0.38)
  Top 0.406: IC1.11 61.62,4.98 v61.89,5.25 | v70.55,31.21 70.58,31.18 U4.41
  Bottom 0.406: v61.89,5.25 61.18,5.96 61.18,9.8 62.04,10.66 68.21,10.66 68.8,11.24 68.8,13.25 68.52,13.53 68.52,14.77 71.77,18.03 73.19,18.03 73.83,18.66 73.83,21.28 75.2,22.65 75.58,22.65 77.05,24.27 77.43,24.65 77.43,25.47 77.1,25.8 77.05,32.28 77.05,33.22 76.11,34.16 73.34,34.16 70.55,31.36 v70.55,31.21
USB_D+  (via drill 0.38)
  Top 0.356: IC1.15 69.5,3.03 v69.79,3.4
  Bottom 0.356: v69.79,3.4 76.01,3.4 77.41,4.72 77.41,5.61 78.93,7.13 78.93,10.18 76.24,12.86
  Bottom 0.381: 76.24,12.86 73.74,15.36 X1.D+
USB_D-  (via drill 0.38)
  Top 0.305: IC1.16 68.5,3.68 68.9,4.08 v70.55,5.61 | v76.54,10.99 78.37,12.82 v78.37,12.84
  Bottom 0.305: v70.55,5.61 70.68,6.11 70.68,7.38 71.49,8.83 73.65,10.99 v76.54,10.99 | v78.37,12.84 74.11,17.11 71.92,17.11 71.46,16.65 71.46,15.39 X1.D-
USB_DTR  (via drill 0.38)
  Top 0.406: IC1.2 58.76,10.83 v58.59,10.66 | v70.37,26.84 70.83,26.38 U4.35
  Bottom 0.305: 58.41,10.84 58.41,11.88 58.71,12.18 58.71,19.83 59.5,20.74 70.78,20.74 73.88,23.89 73.88,25.16 72.89,26.38 70.83,26.38
  Bottom 0.406: v58.59,10.66 58.41,10.84 | 70.83,26.38 v70.37,26.84
USB_UART_RX  (via drill 0.38)
  Top 0.406: IC1.5 58.64,8.88 v58.23,8.47 | v73.09,24.43 73.47,24.43 74.21,25.16 74.21,25.65 77.05,28.24 77.05,33.52 75.88,34.48 74.99,34.48 74,33.49 74,33.19 73.6,32.78 U4.43
  Bottom 0.406: v58.23,8.47 57.65,9.06 57.65,12.36 57.98,12.69 57.98,20.03 59.25,21.4 70.22,21.4 73.09,24.17 v73.09,24.43
USB_UART_TX  (via drill 0.38)
  Top 0.406: IC1.1 60.29,12.16 v59.88,12.56 | v74.92,32.96 73.94,31.98 U4.42
  Bottom 0.305: 75.48,32.4 75.48,30.9 75.32,30.52 75.4,26.15 75.4,25.62 75.58,25.44 75.58,24.02 75.32,23.77 74.61,23.16
  Bottom 0.406: v59.88,12.56 61.05,11.4 67.3,11.4 67.81,11.88 67.81,15.21 71.31,18.71 72.38,18.71 73.09,19.42 73.09,21.76 74.61,23.16 | 75.48,32.4 v74.92,32.96

### Text on the board
tPlace: ADCREG
bPlace: MASTER PROG | COMM PROG | Modular Robotics 2013 | Automated MoBo-A